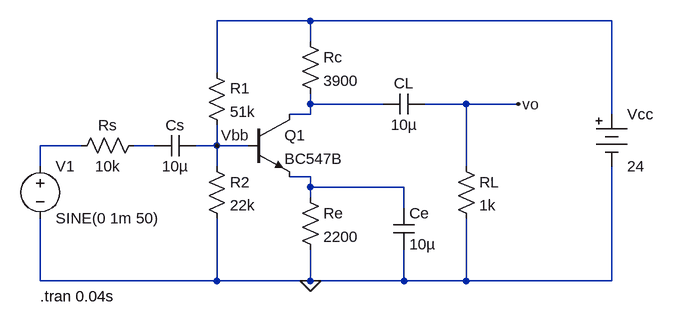
[diagram p0: schematic Draft19.asc]
Draft19.asc, the LTspice schematic file:
Version 4
SHEET 1 880 680
WIRE 288 -80 144 -80
WIRE 752 -80 288 -80
WIRE 288 -48 288 -80
WIRE 144 0 144 -80
WIRE 288 48 288 32
WIRE 400 48 288 48
WIRE 528 48 464 48
WIRE 608 48 528 48
WIRE 288 64 288 48
WIRE 288 64 256 64
WIRE 752 64 752 -80
WIRE -64 112 -128 112
WIRE 48 112 16 112
WIRE 144 112 144 80
WIRE 144 112 112 112
WIRE 192 112 144 112
WIRE -128 144 -128 112
WIRE 144 144 144 112
WIRE 528 144 528 48
WIRE 288 160 256 160
WIRE 288 176 288 160
WIRE 432 176 288 176
WIRE 288 192 288 176
WIRE 432 208 432 176
WIRE -128 320 -128 224
WIRE 144 320 144 224
WIRE 144 320 -128 320
WIRE 288 320 288 272
WIRE 288 320 144 320
WIRE 432 320 432 272
WIRE 432 320 288 320
WIRE 528 320 528 224
WIRE 528 320 432 320
WIRE 752 320 752 144
WIRE 752 320 528 320
FLAG 608 48 vo
FLAG 288 320 0
FLAG 144 112 Vbb
SYMBOL res 128 -16 R0
SYMATTR InstName R1
SYMATTR Value 51k
SYMBOL res 128 128 R0
SYMATTR InstName R2
SYMATTR Value 22k
SYMBOL res 272 176 R0
SYMATTR InstName Re
SYMATTR Value 2200
SYMBOL res 512 128 R0
SYMATTR InstName RL
SYMATTR Value 1k
SYMBOL res 272 -64 R0
SYMATTR InstName Rc
SYMATTR Value 3900
SYMBOL res 32 96 R90
WINDOW 0 0 56 VBottom 2
WINDOW 3 32 56 VTop 2
SYMATTR InstName Rs
SYMATTR Value 10k
SYMBOL cap 112 96 R90
WINDOW 0 0 32 VBottom 2
WINDOW 3 32 32 VTop 2
SYMATTR InstName Cs
SYMATTR Value 10µ
SYMBOL cap 464 32 R90
WINDOW 0 0 32 VBottom 2
WINDOW 3 32 32 VTop 2
SYMATTR InstName CL
SYMATTR Value 10µ
SYMBOL voltage -128 128 R0
WINDOW 123 0 0 Left 0
WINDOW 39 0 0 Left 0
SYMATTR InstName V1
SYMATTR Value SINE(0 1m 50)
SYMBOL Misc\\battery 752 48 R0
SYMATTR InstName Vcc
SYMATTR Value 24
SYMBOL npn 192 64 R0
SYMATTR InstName Q1
SYMATTR Value BC547B
SYMBOL cap 416 208 R0
SYMATTR InstName Ce
SYMATTR Value 10µ
TEXT -128 344 Left 2 !.tran 0.04s

The netlist it stands for:
* Draft19.asc
R1 N001 Vbb 51k
R2 Vbb 0 22k
Re N005 0 2200
RL vo 0 1k
Rc N001 N002 3900
Rs N004 N003 10k
Cs Vbb N004 10µ
CL vo N002 10µ
V1 N003 0 SINE(0 1m 50)
Vcc N001 0 24
Q1 N002 Vbb N005 0 BC547B
Ce N005 0 10µ
.model NPN NPN
.model PNP PNP
.lib standard.bjt
.tran 0.04s
.backanno
.end